# EAGLE schematic max6_breakout_1575AT43A40 (EAGLE 6.1)
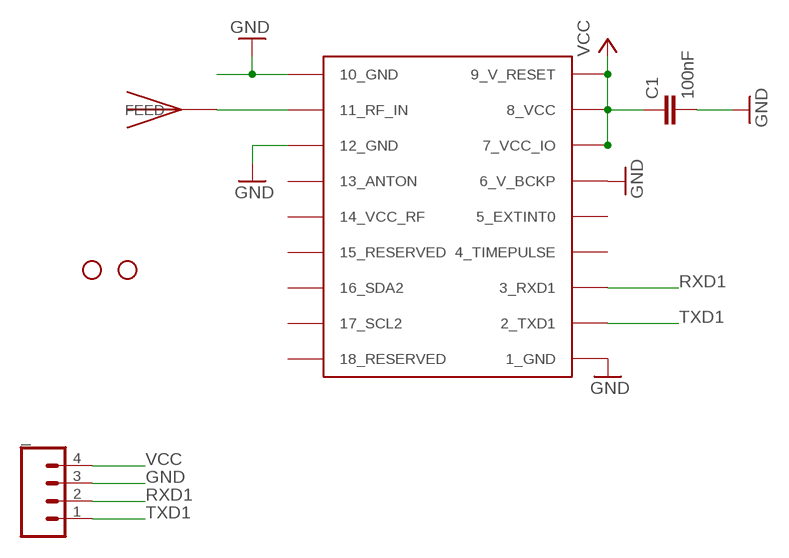
[diagram p0: schematic, sheet 1]

## Parts
_  M04PTH  [1X04]
C1  100nF  CAP0603-CAP  [0603-CAP]
JP1  STAND-OFF  [STAND-OFF]
JP2  STAND-OFF  [STAND-OFF]
U$1  UBLOX_MAX-6  [UBLOX_MAX-6]
U$2  JTI_ANTENNA-1575AT43A40  [JTI_ANTENNA-1575AT43A40]

## Nets
GND: _.3 C1.2 U$1.1_GND U$1.6_V_BCKP U$1.10_GND U$1.12_GND
N$2: U$1.11_RF_IN U$2.FEED
RXD1: _.2 U$1.3_RXD1
TXD1: _.1 U$1.2_TXD1
VCC: _.4 C1.1 U$1.7_VCC_IO U$1.8_VCC U$1.9_V_RESET
Unconnected: U$1.4_TIMEPULSE U$1.5_EXTINT0 U$1.13_ANTON U$1.14_VCC_RF U$1.15_RESERVED U$1.16_SDA2 U$1.17_SCL2 U$1.18_RESERVED

## Library data of the parts
_ = SparkFun:M04: Header 4 Standard 4-pin 0.1" header. Use with straight break away headers (SKU : PRT-00116), right angle break away headers (PRT-00553), swiss pins (PRT-00743), machine pins (PRT-00117), and female headers (PRT-00115). Molex polarized connector foot print use with SKU : PRT-08231 with associated crimp pins and housings. 1MM SMD Version SKU: PRT-10208
C1 = SparkFun:CAP: Capacitor Standard 0603 ceramic capacitor, and 0.1" leaded capacitor.
JP1 JP2 = SparkFun:STAND-OFF: Stand Off This is the mechanical footprint for a #4 phillips button head screw. Use the keepout ring to avoid running the screw head into surrounding components. SKU : PRT-00447
U$1 = ava:UBLOX_MAX-6: UBLOX MAX-6
U$2 = ava:JTI_ANTENNA-1575AT43A40